# Altium schematic sheet MCU A ESP32-WROOM-32U.SchDoc
size A3; Organization: Altium Limited; Address1: L3, 12a Rodborough Rd; Address2: Frenchs Forest; Address3: NSW; Address4: Australia 2086; DocumentNumber: 3; Revision: 0; SheetNumber: 3; SheetTotal: 5; Status: Develop
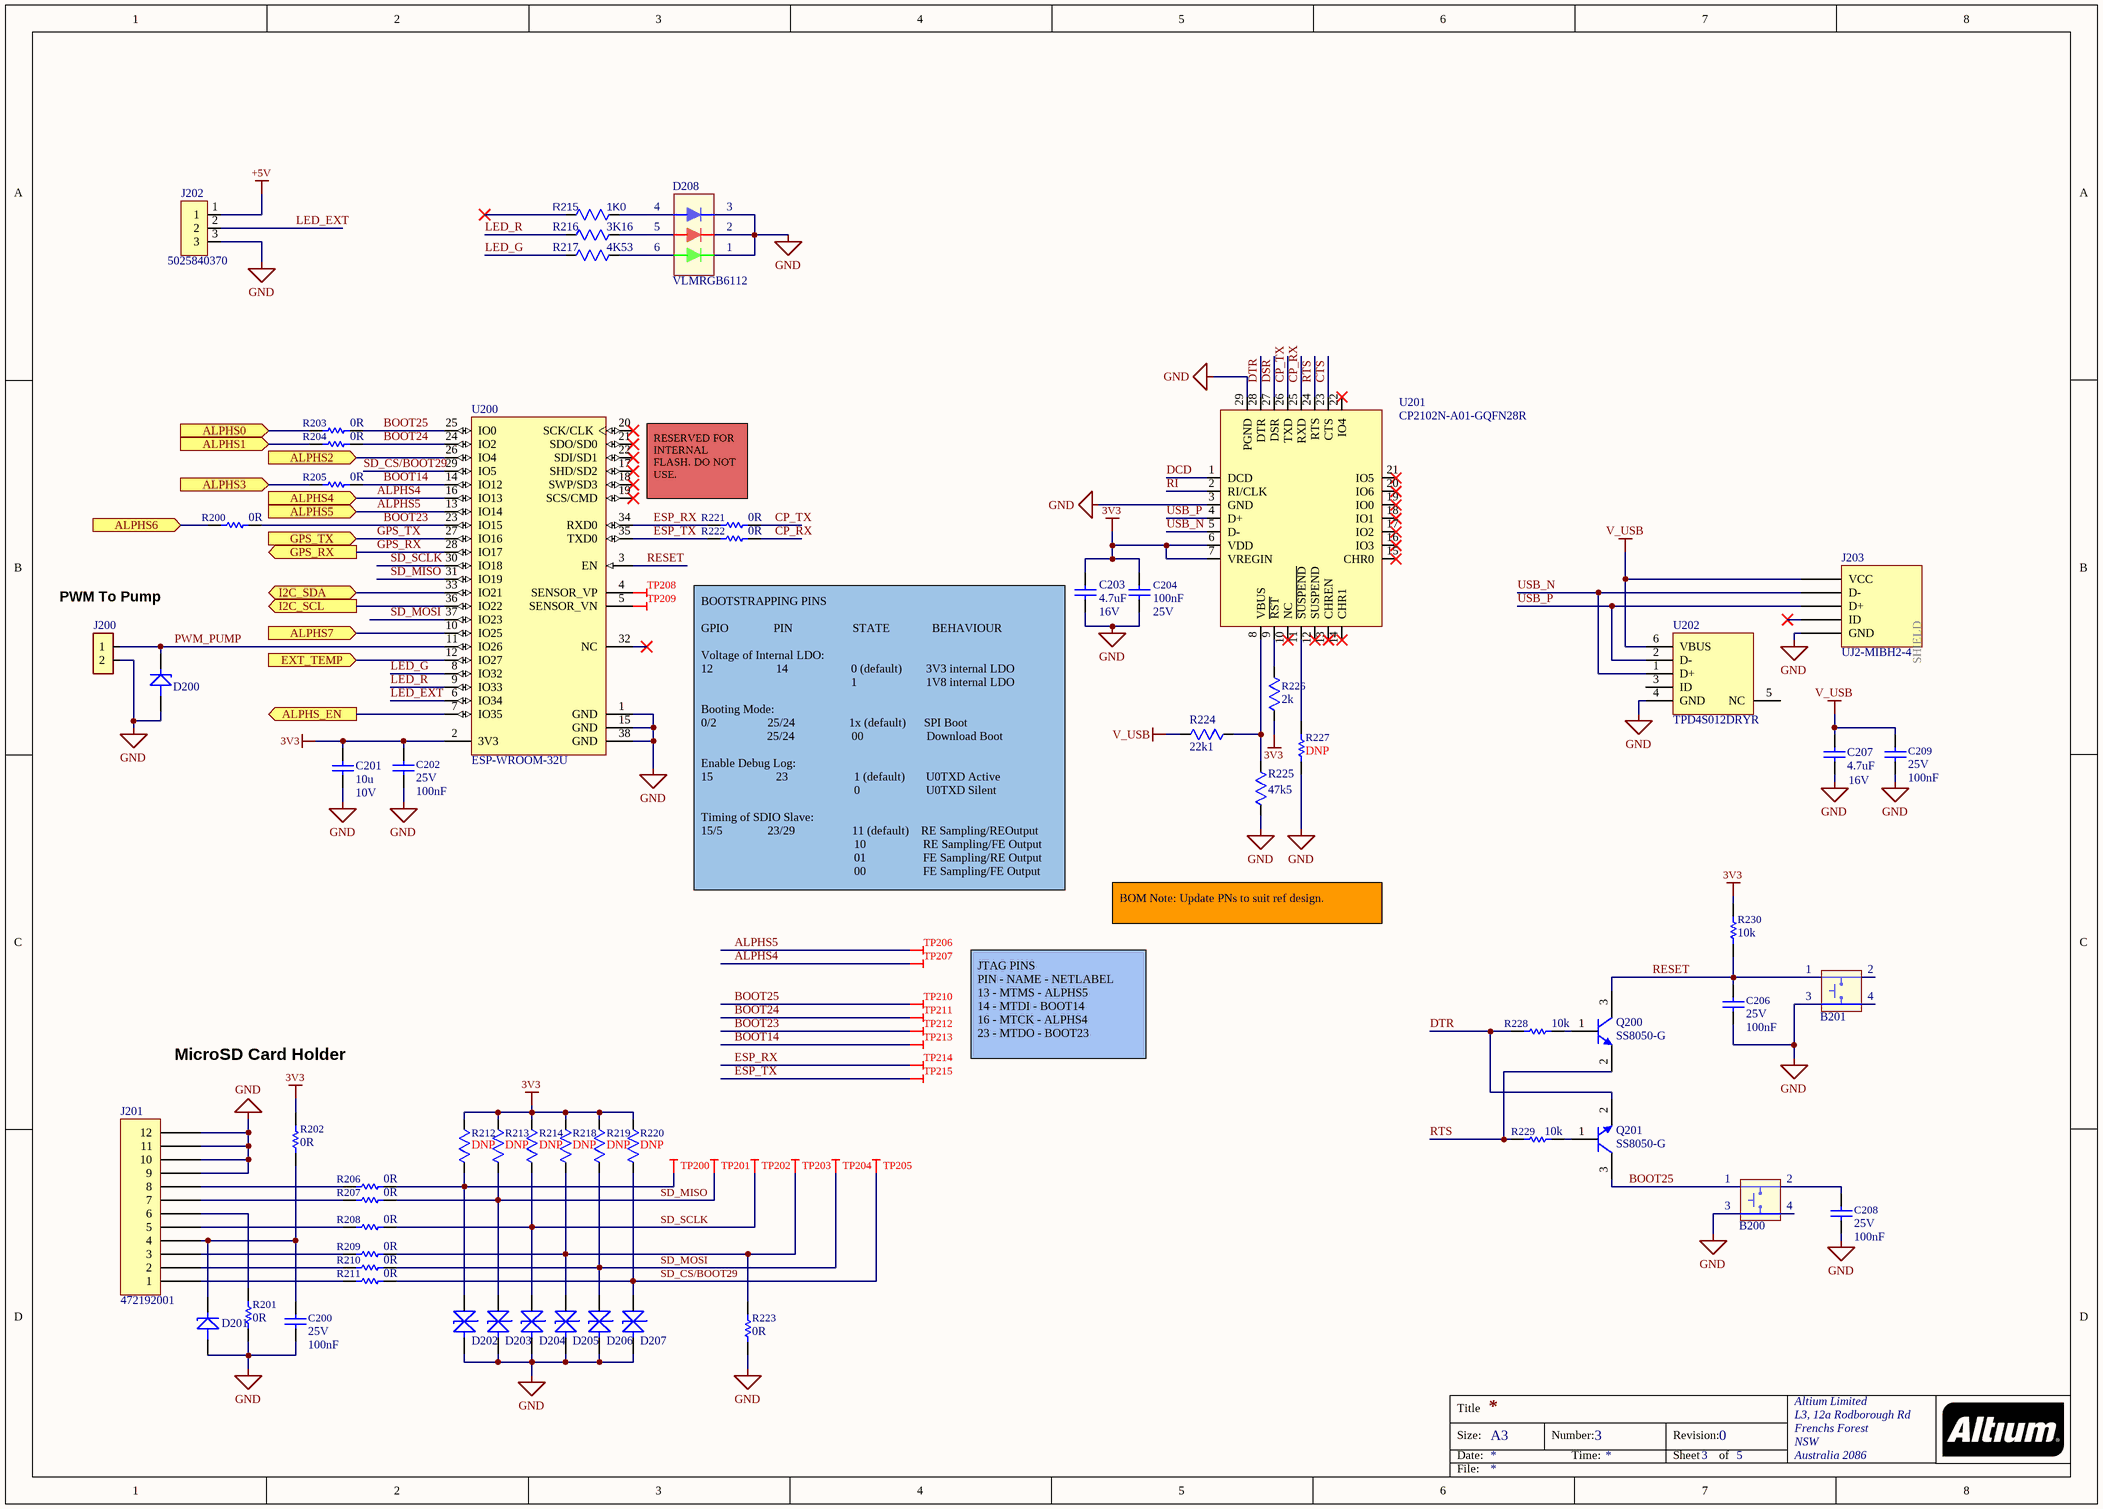
[diagram p0: MCU A ESP32-WROOM-32U.SchDoc]

## Parts
B200  Button C&K PTS815 SJG 250 SMTR LFS  [PTS 815]  (value not drawn)
B201  Button C&K PTS815 SJG 250 SMTR LFS  [PTS 815]  (value not drawn)
C200  value 100nF  Voltage: 25V  [CAPC1005X06N]  (hidden comment: 4.7uF)
C201  value 10u  Voltage: 10V  [CAPC1005X06N]  (hidden comment: CAP: GENERAL)
C202  value 100nF  Voltage: 25V  [CAPC1005X06N]  (hidden comment: 4.7uF)
C203  4.7uF  Voltage: 16V  [C1005[0402]]
C204  value 100nF  Voltage: 25V  [CAPC1005X06N]  (hidden comment: 4.7uF)
C206  value 100nF  Voltage: 25V  [CAPC1005X06N]  (hidden comment: 4.7uF)
C207  4.7uF  Voltage: 16V  [C1005[0402]]
C208  value 100nF  Voltage: 25V  [CAPC1005X06N]  (hidden comment: 4.7uF)
C209  value 100nF  Voltage: 25V  [CAPC1005X06N]  (hidden comment: 4.7uF)
D200  3.3V TVS  [NXP PTVSxS1UR-Series (SOD123W)]  (value not drawn)
D201  3.3V TVS  [NXP PTVSxS1UR-Series (SOD123W)]  (value not drawn)
D202  ESD7951ST5GOSCT-ND  [SODFL100X40-2N]  (value not drawn)
D203  ESD7951ST5GOSCT-ND  [SODFL100X40-2N]  (value not drawn)
D204  ESD7951ST5GOSCT-ND  [SODFL100X40-2N]  (value not drawn)
D205  ESD7951ST5GOSCT-ND  [SODFL100X40-2N]  (value not drawn)
D206  ESD7951ST5GOSCT-ND  [SODFL100X40-2N]  (value not drawn)
D207  ESD7951ST5GOSCT-ND  [SODFL100X40-2N]  (value not drawn)
D208  VLMRGB6112  [VLMRGB6112]
J200  PWM To Pump  [6410/2pin]
J201  472192001  [SD-47219-001]
J202  5025840370  [502584-0370]
J203  UJ2-MIBH2-4  [UJ2-MIBH2-4-SMT]
Q200  SS8050-G  [ONSC-SOT-23-3-318-08_V]
Q201  SS8050-G  [ONSC-SOT-23-3-318-08_V]
R200  value 0R  [RESC1005X03N]  (hidden comment: RES: GENERAL)
R201  value 0R  [RESC1005X03N]  (hidden comment: RES: GENERAL)
R202  value 0R  [RESC1005X03N]  (hidden comment: RES: GENERAL)
R203  value 0R  [RESC1005X03N]  (hidden comment: RES: GENERAL)
R204  value 0R  [RESC1005X03N]  (hidden comment: RES: GENERAL)
R205  value 0R  [RESC1005X03N]  (hidden comment: RES: GENERAL)
R206  value 0R  [RESC1005X03N]  (hidden comment: RES: GENERAL)
R207  value 0R  [RESC1005X03N]  (hidden comment: RES: GENERAL)
R208  value 0R  [RESC1005X03N]  (hidden comment: RES: GENERAL)
R209  value 0R  [RESC1005X03N]  (hidden comment: RES: GENERAL)
R210  value 0R  [RESC1005X03N]  (hidden comment: RES: GENERAL)
R211  value 0R  [RESC1005X03N]  (hidden comment: RES: GENERAL)
R212  value DNP  [RESC1005X03N]  (hidden comment: 10K)
R213  value DNP  [RESC1005X03N]  (hidden comment: 10K)
R214  value DNP  [RESC1005X03N]  (hidden comment: 10K)
R215  1K0  [R1608[0603] small]
R216  3K16  [R1608[0603] small]
R217  4K53  [R1608[0603] small]
R218  value DNP  [RESC1005X03N]  (hidden comment: 10K)
R219  value DNP  [RESC1005X03N]  (hidden comment: 10K)
R220  value DNP  [RESC1005X03N]  (hidden comment: 10K)
R221  value 0R  [RESC1005X03N]  (hidden comment: RES: GENERAL)
R222  value 0R  [RESC1005X03N]  (hidden comment: RES: GENERAL)
R223  value 0R  [RESC1005X03N]  (hidden comment: RES: GENERAL)
R224  22k1  [R1005[0402]]
R225  47k5  [R1005[0402]]
R226  value 2k  [R1005[0402]]  (hidden comment: 10K)
R227  value DNP  [RESC1005X03N]  (hidden comment: RES: GENERAL)
R228  value 10k  [RESC1005X03N]  (hidden comment: RES: GENERAL)
R229  value 10k  [RESC1005X03N]  (hidden comment: RES: GENERAL)
R230  value 10k  [RESC1005X03N]  (hidden comment: RES: GENERAL)
TP200  PAD  [TP_SMD_39MIL]  (value not drawn)  (no BOM)
TP201  PAD  [TP_SMD_39MIL]  (value not drawn)  (no BOM)
TP202  PAD  [TP_SMD_39MIL]  (value not drawn)  (no BOM)
TP203  PAD  [TP_SMD_39MIL]  (value not drawn)  (no BOM)
TP204  PAD  [TP_SMD_39MIL]  (value not drawn)  (no BOM)
TP205  PAD  [TP_SMD_39MIL]  (value not drawn)  (no BOM)
TP206  PAD  [TP_SMD_39MIL]  (value not drawn)  (no BOM)
TP207  PAD  [TP_SMD_39MIL]  (value not drawn)  (no BOM)
TP208  PAD  [TP_SMD_39MIL]  (value not drawn)  (no BOM)
TP209  PAD  [TP_SMD_39MIL]  (value not drawn)  (no BOM)
TP210  PAD  [TP_SMD_39MIL]  (value not drawn)  (no BOM)
TP211  PAD  [TP_SMD_39MIL]  (value not drawn)  (no BOM)
TP212  PAD  [TP_SMD_39MIL]  (value not drawn)  (no BOM)
TP213  PAD  [TP_SMD_39MIL]  (value not drawn)  (no BOM)
TP214  PAD  [TP_SMD_39MIL]  (value not drawn)  (no BOM)
TP215  PAD  [TP_SMD_39MIL]  (value not drawn)  (no BOM)
U200  ESP-WROOM-32U  [OLMX-ESP-WROOM-32]
U201  CP2102N-A01-GQFN28R  [QFN50P500X500X80_HS-29N]
U202  TPD4S012DRYR  [DRY0006A]

## Ports
ALPHS0 (in), ALPHS1 (in), ALPHS2 (in), ALPHS3 (in), ALPHS4 (in), ALPHS5 (in), ALPHS6 (in), ALPHS7 (in), ALPHS_EN (out), EXT_TEMP (in), GPS_RX (out), GPS_TX (in), I2C_SCL (out), I2C_SDA (bidir)

## Nets
3V3: C201.2 C202.1 C203.2 C204.1 R202.1 R212.2 R213.2 R214.2 R218.2 R219.2 R220.2 R226.1 R230.1 U200.2(3V3) U201.6(VDD) U201.7(VREGIN)
+5V: J202.1
GND: B200.3 B201.3 C200.2 C201.1 C202.2 C203.1 C204.2 C206.2 C207.1 C208.2 C209.2 D200.2 D201.2 D202.1(CATHODE) D203.1(CATHODE) D204.1(CATHODE) D205.1(CATHODE) D206.1(CATHODE) D207.1(CATHODE) D208.1(A2) D208.2(C3) D208.3(A3) J200.2 J201.9 J201.10 J201.11 J201.12 J202.3 J203.5(GND) R201.2 R223.2 R225.1 R227.2 U200.1(GND) U200.15(GND) U200.38(GND) U201.3(GND) U201.29(PGND) U202.4(GND)
V_USB: C207.2 C209.1 J203.1(VCC) R224.1 U202.6(VBUS)
ALPHS0: R203.2 ; port ALPHS0
ALPHS1: R204.2 ; port ALPHS1
ALPHS2: U200.26(IO4) ; port ALPHS2
ALPHS3: R205.2 ; port ALPHS3
ALPHS4: TP207.1 U200.16(IO13) ; port ALPHS4
ALPHS5: TP206.1 U200.13(IO14) ; port ALPHS5
ALPHS6: R200.2 ; port ALPHS6
ALPHS7: U200.10(IO25) ; port ALPHS7
ALPHS_EN: U200.7(IO35) ; port ALPHS_EN
BOOT14: R205.1 TP213.1 U200.14(IO12)
BOOT23: R200.1 TP212.1 U200.23(IO15)
BOOT24: R204.1 TP211.1 U200.24(IO2)
BOOT25: B200.1 Q201.3(C) R203.1 TP210.1 U200.25(IO0)
CP_RX: R222.1 U201.25(RXD)
CP_TX: R221.1 U201.26(TXD)
CTS: U201.23(CTS)
DCD: U201.1(DCD)
DSR: U201.27(DSR)
DTR: Q201.2(E) R228.2 U201.28(DTR)
ESP_RX: R221.2 TP214.1 U200.34(RXD0)
ESP_TX: R222.2 TP215.1 U200.35(TXD0)
EXT_TEMP: U200.12(IO27) ; port EXT_TEMP
GPS_RX: U200.28(IO17) ; port GPS_RX
GPS_TX: U200.27(IO16) ; port GPS_TX
I2C_SCL: U200.36(IO22) ; port I2C_SCL
I2C_SDA: U200.33(IO21) ; port I2C_SDA
LED_EXT: J202.2 U200.6(IO34)
LED_G: R217.1 U200.8(IO32)
LED_R: R216.1 U200.9(IO33)
PWM_PUMP: D200.1 J200.1 U200.11(IO26)
RESET: B201.1 C206.1 Q200.3(C) R230.2 U200.3(EN)
RI: U201.2(RI/CLK)
RTS: Q200.2(E) R229.2 U201.24(RTS)
SD_CS/BOOT29: D207.2(ANODE) R211.1 R220.1 TP205.1 U200.29(IO5)
SD_MISO: D203.2(ANODE) R207.1 R213.1 TP201.1 U200.31(IO19)
SD_MOSI: D206.2(ANODE) R210.1 R219.1 TP204.1 U200.37(IO23)
SD_SCLK: D204.2(ANODE) R208.1 R214.1 TP202.1 U200.30(IO18)
USB_N: J203.2(D-) U201.5(D-) U202.1(D+)
USB_P: J203.3(D+) U201.4(D+) U202.2(D-)
NetB200_2: B200.2 C208.1
NetC200_1: C200.1 D201.1 J201.4 R202.2
NetD202_2: D202.2(ANODE) R206.1 R212.1 TP200.1
NetD205_2: D205.2(ANODE) R209.1 R218.1 R223.1 TP203.1
NetD208_4: D208.4(C1) R215.2
NetD208_5: D208.5(C1) R216.2
NetD208_6: D208.6(C1) R217.2
NetJ201_1: J201.1 R211.2
NetJ201_2: J201.2 R210.2
NetJ201_3: J201.3 R209.2
NetJ201_5: J201.5 R208.2
NetJ201_6: J201.6 R201.1
NetJ201_7: J201.7 R207.2
NetJ201_8: J201.8 R206.2
NetQ200_1: Q200.1(B) R228.1
NetQ201_1: Q201.1(B) R229.1
NetR224_2: R224.2 R225.2 U201.8(VBUS)
NetR226_2: R226.2 U201.9(~{RST})
NetR227_1: R227.1 U201.11(~{SUSPEND})
NetTP208_1: TP208.1 U200.4(SENSOR_VP)
NetTP209_1: TP209.1 U200.5(SENSOR_VN)

Not connected (* = marked no-connect by the designer): B200 4; B201 2 4; J203 4(ID)*; R215 1*; U200 17(SHD/SD2)* 18(SWP/SD3)* 19(SCS/CMD)* 20(SCK/CLK)* 21(SDO/SD0)* 22(SDI/SD1)* 32(NC)*; U201 10(NC)* 12(SUSPEND)* 13(CHREN)* 14(CHR1)* 15(CHR0)* 16(IO3)* 17(IO2)* 18(IO1)* 19(IO0)* 20(IO6)* 21(IO5)* 22(IO4)*; U202 3(ID) 5(NC)

## Notes on the sheet
- RESERVED FOR INTERNAL FLASH. DO NOT USE.
- (near C203) BOOTSTRAPPING PINS
  GPIO               PIN                    STATE              BEHAVIOUR
  Voltage of Internal LDO:
  12                     14                     0 (default)        3V3 internal LDO
  1                       1V8 internal LDO
  Booting Mode:
  0/2                 25/24                  1x (default)      SPI Boot
  25/24                   00                     Download Boot
  Enable Debug Log:
  15                     23                      1 (default)       U0TXD Active
  0                      U0TXD Silent
  Timing of SDIO Slave:
  15/5               23/29                   11 (default)    RE Sampling/REOutput
  10                   RE Sampling/FE Output
  01                   FE Sampling/RE Output
  00                   FE Sampling/FE Output
- BOM Note: Update PNs to suit ref design.
- JTAG PINS
  PIN - NAME - NETLABEL
  13 - MTMS - ALPHS5
  14 - MTDI - BOOT14
  16 - MTCK - ALPHS4
  23 - MTDO - BOOT23
- MicroSD Card Holder
- Title
- Size:
- Date:
- A3
- Number:
- Time:
- Revision:
- Sheet
- of
- File:
- (in symbol USB Shield) SHIELD

## Library data of the parts
B200 B201 = Button C&K PTS815 SJG 250 SMTR LFS: Push Button Top; Manufacturer: C&K Components; Supplier 1: Digi-Key; Manufacturer Part Number: PTS815 SJG 250 SMTR LFS; ComponentLink1URL: http://datasheet.octopart.com/PTS815-SJG-250-SMTR-LFS-C%26K-Components-datasheet-130077068.pdf?src-supplier=Allied+Electronics; ComponentLink1Description: http://datasheet.octopart.com/PTS815-SJG-250-SMTR-LFS-C%26K-Components-datasheet-130077068.pdf?src-supplier=Allied+Electronics; Supplier Part Number 1: CKN12217-1-ND
C200 C202 C204 C206 C208 C209 = 4.7uF_0603_10V: Manufacturer Part Number: CL05A104KA5NNNC; Manufacturer: Samsung; ComponentLink1URL: http://www.murata.com/~/media/webrenewal/support/library/catalog/products/capacitor/mlcc/c02e.pdf; ComponentLink1Description: http://www.murata.com/~/media/webrenewal/support/library/catalog/products/capacitor/mlcc/c02e.pdf; Supplier 1: Digi-Key; Supplier Part Number 1: 1276-1043-1-ND
C201 = CAP: GENERAL: Capacitor; Manufacturer Part Number: CL05A106MP8NUB8; Manufacturer: Samsung; Distributor Part Number: *; Accuracy: *; Type: *; Package: *; Supplier 1: Digi-Key; Supplier Part Number 1: 1276-6830-1-ND
C203 C207 = 4.7uF_0402_10V: Cap,4.7uF,10V,20%,X5R,0402; Manufacturer: Samsung Electro-Mechanics; Manufacturer Part Number: CL05A475MO5NUNC; Supplier 1: Digi-Key; Supplier Part Number 1: 1276-6836-1-ND; Value: 4.7uF
D200 D201 = NXP PTVSxS1UR-Series: Manufacturer: Nexperia; Manufacturer Part Number: PTVS3V3S1UTR,115; Supplier 1: Digi-Key; Supplier Part Number 1: 1727-1416-1-ND
D202-D207 = ESD7951S: TVS Diode; Manufacturer: ON Semiconductor; Supplier Part Number 1: ESD7951ST5GOSCT-ND; Manufacturer Part Number: ESD7951ST5G; Supplier 1: Digi-Key
D208 = VLMRGB6112: LED RGB Clear 624nm/526nm/469nm 2V/3.1V/3V PLCC-6; Manufacturer: Vishay Semiconductor Opto Division; Manufacturer Part Number: VLMRGB6112-00-GS08; TZOA PN: 250-00002; Supplier 1: Digi-Key; Supplier Part Number 1: VLMRGB6112-00-GS08CT-ND
J200 = CON2: Connector 2 pin; Manufacturer: Molex; Manufacturer Part Number: 0022232023; Supplier 1: Digi-Key; Supplier Part Number 1: WM19468-ND
J201 = CON12: Manufacturer: Molex; Manufacturer Part Number: 0472192001; Supplier Part Number 1: WM6698CT-ND; Supplier 1: Digi-Key
J202 = CONN: 3x1: Manufacturer: Molex; Manufacturer Part Number: 5025840370; Supplier 1: Digi-Key; Supplier Part Number 1: WM14461CT-ND
J203 = USB Shield: Manufacturer: CUI; Manufacturer Part Number: UJ2-MIBH2-4-SMT-TR; Supplier Part Number 1: 102-4007-1-ND; Supplier 1: Digi-Key
Q200 Q201 = CMP-1048-00571-1: General Purpose Transistor, NPN Silicon, 3-Pin SOT-23, Tape and Reel; Manufacturer: Comchip Technology; ComponentLink3Description: Package Specification; ComponentLink2URL: http://www.onsemi.cn/pub_link/Collateral/MMBT2222LT1-D.PDF; ComponentLink1URL: http://www.onsemi.com/; ComponentLink2Description: Datasheet; ComponentLink3URL: http://www.onsemi.cn/pub_link/Collateral/318-08.PDF; ComponentLink1Description: Manufacturer URL; Supplier 1: Digi-Key; Manufacturer Part Number: SS8050-G; Supplier Part Number 1: 641-1790-1-ND
R200-R211 R221-R223 = RES: GENERAL: Manufacturer: Panasonic; Manufacturer Part Number: ERJ-2GE0R00X; Accuracy: *; Distributor Part Number: *; Power: *; Type: *; Distributor: Digi-Key; Package: *; Supplier 1: Digi-Key; Supplier Part Number 1: P0.0JCT-ND
R212-R214 R218-R220 = 1K00_0603_0.1W: RES 1K Ohm ±5%, 0.25W,1/4W 0603; ComponentLink1URL: https://datasheet.ciiva.com/2469/esr-2469603.pdf; ComponentLink1Description: https://datasheet.ciiva.com/2469/esr-2469603.pdf; ComponentLink2URL: https://datasheet.ciiva.com/2469/esr-2469604.pdf; ComponentLink2Description: https://datasheet.ciiva.com/2469/esr-2469604.pdf; ComponentLink3URL: https://datasheet.ciiva.com/2469/esr-2469605.pdf; ComponentLink3Description: https://datasheet.ciiva.com/2469/esr-2469605.pdf; Manufacturer: N/A; Manufacturer Part Number: N/A; Supplier 1: N/A; Supplier Part Number 1: N/A
R215 = 1K00_0603_0.1W: RES 1K Ohm ±5%, 0.25W,1/4W 0603; Manufacturer: Rohm; Manufacturer Part Number: ESR03EZPJ102; TZOA PN: 209-00007; Product Training Modules: Resistor Products Overview; Featured Product: ROHM Chip Resistors; EDA / CAD Models: Download from Accelerated Designs; Temperature Coefficient: ±200ppm/°C; Online Catalog: ESR03 Series; Other Names: RHM1.0KDDKR; Supplier 1: Digi-Key; Stock 1: 63701; Pricing 1: 1=0.11, 10=0.098, 100=0.0378, 1000=0.0166, 2500=0.0144 (USD); Standard Package: 1; Category: Resistors; Family: Chip Resistor - Surface Mount; Series: ESR; Packaging: Cut Tape (CT); Resistance (Ohms): 1k; Tolerance: ±5%; Power (Watts): 0.25W, 1/4W; Composition: Thick Film; Features: Automotive AEC-Q200, Pulse Withstanding; Operating Temperature: -55°C ~ 155°C; Package / Case: 0603 (1608 Metric); Supplier Device Package: 0603 (1608 Metric); Size / Dimension: 0.063" L x 0.031" W (1.60mm x 0.80mm); Height: 0.022" (0.55mm); Number of Terminations: 2; ComponentLink1URL: https://datasheet.ciiva.com/2469/esr-2469603.pdf; ComponentLink1Description: https://datasheet.ciiva.com/2469/esr-2469603.pdf; ComponentLink2URL: https://datasheet.ciiva.com/2469/esr-2469604.pdf; ComponentLink2Description: https://datasheet.ciiva.com/2469/esr-2469604.pdf; ComponentLink3URL: https://datasheet.ciiva.com/2469/esr-2469605.pdf; ComponentLink3Description: https://datasheet.ciiva.com/2469/esr-2469605.pdf; Supplier Part Number 1: RHM1.0KDCT-ND
R216 = 3K16_Resistor_0603: Res,SMD,1/10W,3K16,0603,1%; Manufacturer: Stackpole Electronics; Manufacturer Part Number: RMCF0603FT3K16; Supplier 2: Arrow; Supplier 1: Digi-Key; Supplier Part Number 2: RMCF0603FT3K16; Supplier Part Number 1: RMCF0603FT3K16CT-ND
R217 = 4K53_Resistor_0603: Res,SMD,4K53,1/10W,1%,0603; Manufacturer: Yageo; Manufacturer Part Number: RC0603FR-074K53L; Supplier 2: Arrow; Supplier 1: Digi-Key; Supplier Part Number 2: RC0603FR-074K53L; Supplier Part Number 1: 311-4.53KHRCT-ND
R224 = 22K_0603_1/4W: Res,SMD,22k,0603,5%,1/4W; Manufacturer Part Number: ERJ-2RKF2212X; Manufacturer: Panasonic; Supplier 1: Digi-Key; Supplier Part Number 1: P22.1KLCT-ND
R225 = 22K_0603_1/4W: Res,SMD,22k,0603,5%,1/4W; Manufacturer Part Number: ERJ-2RKF4752X; Manufacturer: Panasonic; Supplier 1: Digi-Key; Supplier Part Number 1: P47.5KLCT-ND
R226 = 1K00_0603_0.1W: Manufacturer: Panasonic; Manufacturer Part Number: ERJ-2RKF2001X; Supplier 1: Digi-Key; ComponentLink1URL: https://datasheet.ciiva.com/2469/esr-2469603.pdf; ComponentLink1Description: https://datasheet.ciiva.com/2469/esr-2469603.pdf; ComponentLink2URL: https://datasheet.ciiva.com/2469/esr-2469604.pdf; ComponentLink2Description: https://datasheet.ciiva.com/2469/esr-2469604.pdf; ComponentLink3URL: https://datasheet.ciiva.com/2469/esr-2469605.pdf; ComponentLink3Description: https://datasheet.ciiva.com/2469/esr-2469605.pdf; Supplier Part Number 1: P2.00KLDKR-ND
R228-R230 = RES: GENERAL: Manufacturer: Panasonic; Manufacturer Part Number: ERJ-2RKF1002X; Accuracy: *; Distributor Part Number: *; Power: *; Type: *; Distributor: Digi-Key; Package: *; Supplier 1: Digi-Key; Supplier Part Number 1: P10.0KLCT-ND
TP200-TP215 = TP_SMD_39MIL: SMD Test Pad; Manufacturer: No P/N Required; P/N: No P/N; UM: EA; Fast Supplier: No P/N Required; Fast Supplier P/N: No P/N Required; Manufacturer P/N: No P/N Required
U200 = CMP-2000-07454-1: Espressif System, 2.7 to 3.6 V, -40 to 85 degC, 38-Pin SMD; Manufacturer: Espressif Systems; Manufacturer Part Number: ESP32-WROOM-32U; Package Description: 38-Pin Surface Mount Device, Body 18 x 25.5 mm, Pitch 1.27 mm; Manufacturer URL: https://www.olimex.com; RoHSCompliant: false; Mounting Technology: SurfaceMount; Datasheet Version: Rev. 2.1, 09/2017; Datasheet URL: http://www.espressif.com/sites/default/files/documentation/esp-wroom-32_datasheet_en.pdf; Package Reference: ESP-WROOM-32; Supplier 1: Digi-Key; Supplier Part Number 1: 1904-1026-1-ND
U201 = CP2102N QFN28: USB to UART converter; Manufacturer: Silicon Labs; Supplier 1: Digi-Key; Supplier Part Number 1: 336-4738-1-ND; Manufacturer Part Number: CP2102N-A01-GQFN28R
U202 = CMP-0326-00038-3: USB ESD Solution with Power Clamp, 4 Channels, -40 to +85 degC, 6-pin SON (DRY), Green (RoHS & no Sb/Br); Manufacturer: Texas Instruments; IO Capacitance(Typ)(pF): 0.8; USB High Speed: TRUE; IEC 61000-4-2 Air-Gap(+/- kV): 10; Breakdown Voltage(Min)(V): 6; PackageDescription: 6-Pin Plastic Small Outline No-Lead, 1 x 1.45 x 0.6 mm Body, 0.5 mm Pitch; ComponentLink2URL: http://www.ti.com/general/docs/lit/getliterature.tsp?genericPartNumber=TPD4S012&fileType=pdf; PackageVersion: revF, Dec-2011; ComponentLink3URL: SamplesURL:http://www.ti.com/product/tpd4s012#samples; ComponentLink2Description: Datasheet; IEC 61000-4-2 Contact(+/- kV): 10; DatasheetVersion: SLVS928A; PackageReference: DRY0006A; ComponentLink3Description: URL Link1; Mounting Technology: Surface Mount; PartNumber: TPD4S012DRYR; ComponentLink1Description: Manufacturer URL; SubFamily: ESD Solution; IO Leakage Current(nA): 10; ComponentLink1URL: http://www.ti.com/; Eco-Plan: Green (RoHS & no Sb/Br); Manufacturer Part Number: TPD4S012DRYR; Supplier 1: Digi-Key; Supplier Part Number 1: 296-24244-1-ND
R227 = RES: GENERAL: Accuracy: *; Manufacturer: N/A; Manufacturer Part Number: N/A; Distributor Part Number: *; Power: *; Type: *; Distributor: N/A; Package: *; Supplier 1: N/A; Supplier 1 Part Number: N/A